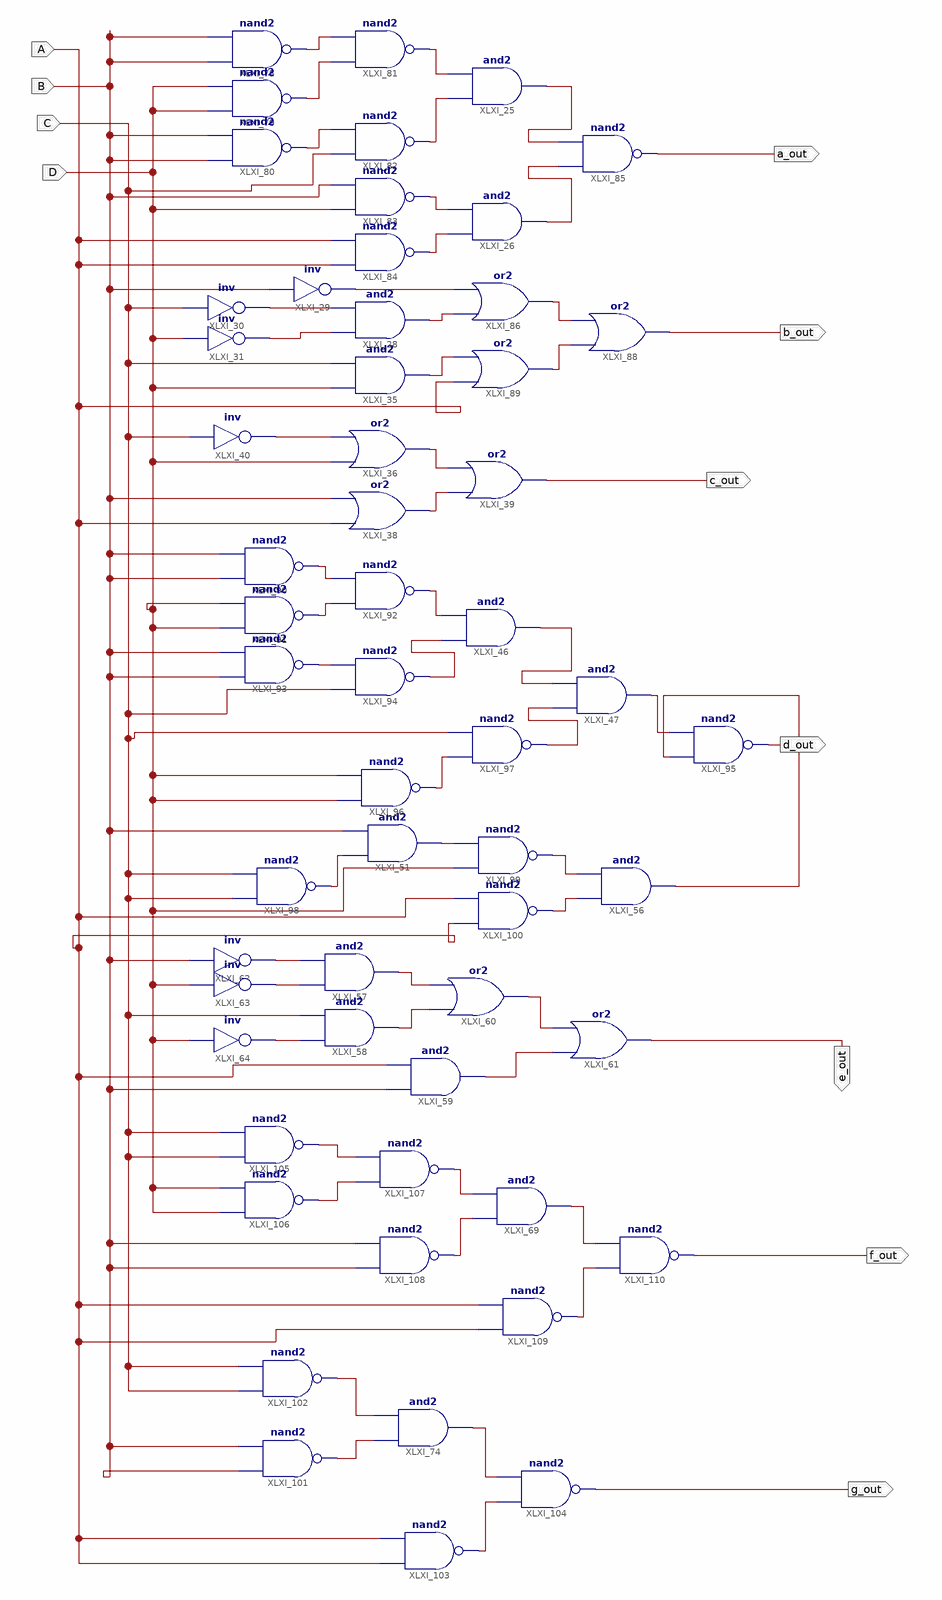
[diagram p0: schematic sheet 1]
// Xilinx ISE schematic Lab05.sch (spartan6) as structural Verilog: 57 symbols, 11 ports
module Lab05 (
  input  A,
  input  B,
  input  C,
  input  D,
  output a_out,
  output b_out,
  output c_out,
  output e_out,
  output f_out,
  output g_out,
  output d_out
);

  wire XLXN_2, XLXN_3, XLXN_4, XLXN_7, XLXN_8, XLXN_9, XLXN_10, XLXN_11, XLXN_12, XLXN_13, XLXN_14, XLXN_15,
       XLXN_16, XLXN_18, XLXN_19, XLXN_20, XLXN_23, XLXN_24, XLXN_25, XLXN_28, XLXN_29, XLXN_30, XLXN_31,
       XLXN_32, XLXN_33, XLXN_34, XLXN_35, XLXN_36, XLXN_38, XLXN_39, XLXN_40, XLXN_41, XLXN_42, XLXN_44,
       XLXN_45, XLXN_46, XLXN_47, XLXN_48, XLXN_49, XLXN_50, XLXN_52, XLXN_53, XLXN_54, XLXN_56, XLXN_57,
       XLXN_58, XLXN_60, XLXN_61, XLXN_62, XLXN_63;

  and XLXI_25 (XLXN_4, XLXN_9, XLXN_8);
  and XLXI_26 (XLXN_7, XLXN_11, XLXN_10);
  and XLXI_28 (XLXN_16, XLXN_14, XLXN_13);
  not XLXI_29 (XLXN_15, B);
  not XLXI_30 (XLXN_13, C);
  not XLXI_31 (XLXN_14, D);
  and XLXI_35 (XLXN_20, D, C);
  or XLXI_36 (XLXN_23, D, XLXN_25);
  or XLXI_38 (XLXN_24, A, B);
  or XLXI_39 (c_out, XLXN_24, XLXN_23);
  not XLXI_40 (XLXN_25, C);
  and XLXI_46 (XLXN_35, XLXN_32, XLXN_31);
  and XLXI_47 (XLXN_36, XLXN_34, XLXN_35);
  and XLXI_51 (XLXN_39, XLXN_38, B);
  and XLXI_56 (XLXN_40, XLXN_42, XLXN_41);
  and XLXI_57 (XLXN_47, XLXN_45, XLXN_44);
  and XLXI_58 (XLXN_48, XLXN_46, C);
  and XLXI_59 (XLXN_50, B, A);
  or XLXI_60 (XLXN_49, XLXN_48, XLXN_47);
  or XLXI_61 (e_out, XLXN_50, XLXN_49);
  not XLXI_62 (XLXN_44, B);
  not XLXI_63 (XLXN_45, D);
  not XLXI_64 (XLXN_46, D);
  and XLXI_69 (XLXN_57, XLXN_56, XLXN_54);
  and XLXI_74 (XLXN_62, XLXN_61, XLXN_60);
  nand XLXI_78 (XLXN_2, B, B);
  nand XLXI_79 (XLXN_3, D, D);
  nand XLXI_80 (XLXN_12, B, B);
  nand XLXI_81 (XLXN_8, XLXN_3, XLXN_2);
  nand XLXI_82 (XLXN_9, C, XLXN_12);
  nand XLXI_83 (XLXN_10, D, B);
  nand XLXI_84 (XLXN_11, A, A);
  nand XLXI_85 (a_out, XLXN_7, XLXN_4);
  or XLXI_86 (XLXN_18, XLXN_16, XLXN_15);
  or XLXI_88 (b_out, XLXN_19, XLXN_18);
  or XLXI_89 (XLXN_19, A, XLXN_20);
  nand XLXI_90 (XLXN_28, B, B);
  nand XLXI_91 (XLXN_29, D, D);
  nand XLXI_92 (XLXN_31, XLXN_29, XLXN_28);
  nand XLXI_93 (XLXN_30, B, B);
  nand XLXI_94 (XLXN_32, C, XLXN_30);
  nand XLXI_95 (d_out, XLXN_40, XLXN_36);
  nand XLXI_96 (XLXN_33, D, D);
  nand XLXI_97 (XLXN_34, XLXN_33, C);
  nand XLXI_98 (XLXN_38, C, C);
  nand XLXI_99 (XLXN_41, D, XLXN_39);
  nand XLXI_100 (XLXN_42, A, A);
  nand XLXI_101 (XLXN_61, B, B);
  nand XLXI_102 (XLXN_60, C, C);
  nand XLXI_103 (XLXN_63, A, A);
  nand XLXI_104 (g_out, XLXN_63, XLXN_62);
  nand XLXI_105 (XLXN_52, C, C);
  nand XLXI_106 (XLXN_53, D, D);
  nand XLXI_107 (XLXN_54, XLXN_53, XLXN_52);
  nand XLXI_108 (XLXN_56, B, B);
  nand XLXI_109 (XLXN_58, A, A);
  nand XLXI_110 (f_out, XLXN_58, XLXN_57);
endmodule
